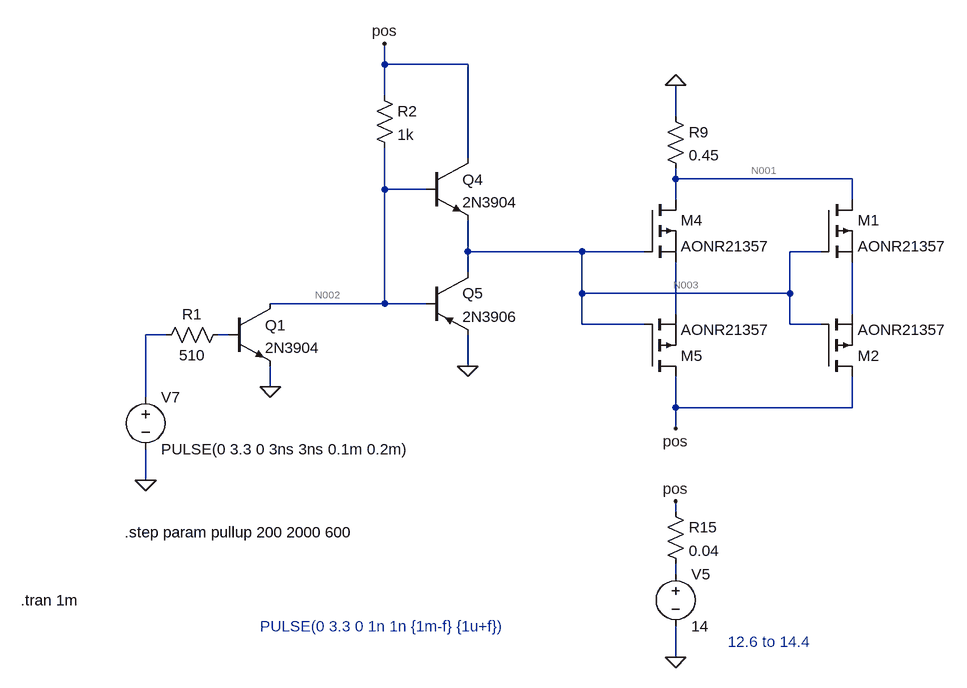
[diagram p0: schematic MOSFET switch circuit- correct.asc]
MOSFET switch circuit- correct.asc, the LTspice schematic file:
Version 4
SHEET 1 880 680
WIRE -1456 -272 -1456 -304
WIRE -1328 -272 -1456 -272
WIRE -1456 -224 -1456 -272
WIRE -1008 -192 -1008 -240
WIRE -1328 -128 -1328 -272
WIRE -1008 -96 -1008 -112
WIRE -736 -96 -1008 -96
WIRE -1456 -80 -1456 -144
WIRE -1392 -80 -1456 -80
WIRE -1008 -64 -1008 -96
WIRE -736 -64 -736 -96
WIRE -1328 16 -1328 -32
WIRE -1152 16 -1328 16
WIRE -1056 16 -1152 16
WIRE -784 16 -832 16
WIRE -1328 48 -1328 16
WIRE -1152 80 -1152 16
WIRE -832 80 -832 16
WIRE -832 80 -1152 80
WIRE -1456 96 -1456 -80
WIRE -1456 96 -1632 96
WIRE -1392 96 -1456 96
WIRE -1008 112 -1008 32
WIRE -736 112 -736 32
WIRE -1152 128 -1152 80
WIRE -1056 128 -1152 128
WIRE -832 128 -832 80
WIRE -784 128 -832 128
WIRE -1792 144 -1824 144
WIRE -1696 144 -1712 144
WIRE -1328 192 -1328 144
WIRE -1632 224 -1632 192
WIRE -1824 240 -1824 144
WIRE -1008 256 -1008 208
WIRE -736 256 -736 208
WIRE -736 256 -1008 256
WIRE -1008 288 -1008 256
WIRE -1824 368 -1824 320
WIRE -1008 416 -1008 400
WIRE -1008 512 -1008 496
WIRE -1008 640 -1008 592
FLAG -1824 368 0
FLAG -1008 640 0
FLAG -1008 288 pos
FLAG -1008 -240 0
FLAG -1008 400 pos
FLAG -1328 192 0
FLAG -1456 -304 pos
FLAG -1632 224 0
SYMBOL voltage -1008 496 R0
WINDOW 123 0 0 Left 0
WINDOW 39 0 0 Left 0
SYMATTR InstName V5
SYMATTR Value 14
SYMBOL pmos -1056 -64 R0
SYMATTR InstName M4
SYMATTR Value AONR21357
SYMBOL pmos -1056 208 M180
SYMATTR InstName M5
SYMATTR Value AONR21357
SYMBOL res -1024 -208 R0
SYMATTR InstName R9
SYMATTR Value 0.45
SYMBOL npn -1392 -128 R0
WINDOW 0 56 33 Left 2
SYMATTR InstName Q4
SYMATTR Value 2N3904
SYMBOL voltage -1824 224 R0
WINDOW 123 0 0 Left 0
WINDOW 39 0 0 Left 0
SYMATTR InstName V7
SYMATTR Value PULSE(0 3.3 0 3ns 3ns 0.1m 0.2m)
SYMBOL res -1024 400 R0
SYMATTR InstName R15
SYMATTR Value 0.04
SYMBOL pnp -1392 48 R0
SYMATTR InstName Q5
SYMATTR Value 2N3906
SYMBOL res -1472 -240 R0
SYMATTR InstName R2
SYMATTR Value 1k
SYMBOL npn -1696 96 R0
WINDOW 0 56 33 Left 2
SYMATTR InstName Q1
SYMATTR Value 2N3904
SYMBOL res -1696 128 R90
WINDOW 0 0 56 VBottom 2
WINDOW 3 32 56 VTop 2
SYMATTR InstName R1
SYMATTR Value 510
SYMBOL pmos -784 -64 R0
SYMATTR InstName M1
SYMATTR Value AONR21357
SYMBOL pmos -784 208 M180
SYMATTR InstName M2
SYMATTR Value AONR21357
TEXT -2016 552 Left 2 !.tran 1m
TEXT -1856 448 Left 2 !.step param pullup 200 2000 600
TEXT -928 616 Left 2 ;12.6 to 14.4
TEXT -1648 592 Left 2 ;PULSE(0 3.3 0 1n 1n {1m-f} {1u+f})

The netlist it stands for:
* MOSFET switch circuit- correct.asc
V5 N008 0 14
M4 N001 N003 N004 N004 AONR21357
M5 pos N003 N004 N004 AONR21357
R9 0 N001 0.45
Q4 pos N002 N003 0 2N3904
V7 N006 0 PULSE(0 3.3 0 3ns 3ns 0.1m 0.2m)
R15 pos N008 0.04
Q5 N003 N002 0 0 2N3906
R2 pos N002 1k
Q1 N002 N007 0 0 2N3904
R1 N007 N006 510
M1 N001 N003 N005 N005 AONR21357
M2 pos N003 N005 N005 AONR21357
.model NPN NPN
.model PNP PNP
.lib standard.bjt
.model NMOS NMOS
.model PMOS PMOS
.lib standard.mos
.tran 1m
.step param pullup 200 2000 600
* 12.6 to 14.4
* PULSE(0 3.3 0 1n 1n {1m-f} {1u+f})
.backanno
.end

* Results of the author's LTspice run, read from the files saved beside the schematic
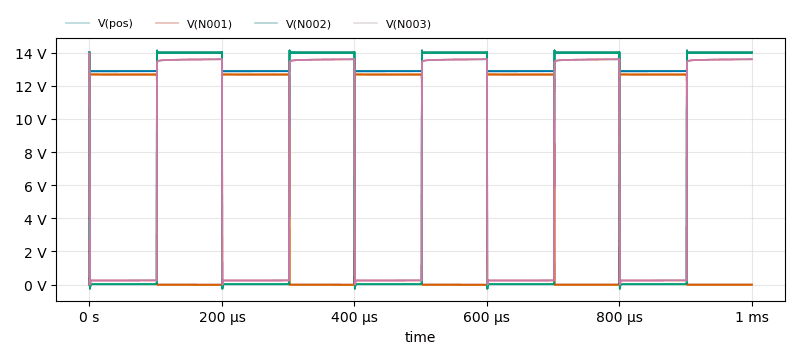
[diagram p1: Transient Analysis of MOSFET switch circuit- correct.asc, plotted from the saved traces]
* Transient Analysis, 4 runs:
*   V(pos) [pullup=200]: min 12.86 V, max 14 V, average 13.43 V, rms 13.44 V, last 14 V
*   V(pos) [pullup=800]: min 12.86 V, max 14 V, average 13.43 V, rms 13.44 V, last 14 V
*   V(pos) [pullup=1400]: min 12.86 V, max 14 V, average 13.43 V, rms 13.44 V, last 14 V
*   V(pos) [pullup=2000]: min 12.86 V, max 14 V, average 13.43 V, rms 13.44 V, last 14 V
*   V(N001) [pullup=200]: min -18.97 mV, max 12.68 V, average 6.446 V, rms 9.038 V, last 0 V
*   V(N001) [pullup=800]: min -18.97 mV, max 12.68 V, average 6.446 V, rms 9.038 V, last 0 V
*   V(N001) [pullup=1400]: min -18.97 mV, max 12.68 V, average 6.446 V, rms 9.038 V, last 0 V
*   V(N001) [pullup=2000]: min -18.97 mV, max 12.68 V, average 6.446 V, rms 9.038 V, last 0 V
*   V(N002) [pullup=200]: min -252.3 mV, max 14.13 V, average 6.901 V, rms 9.817 V, last 14 V
*   V(N002) [pullup=800]: min -252.3 mV, max 14.13 V, average 6.901 V, rms 9.817 V, last 14 V
*   V(N002) [pullup=1400]: min -252.3 mV, max 14.13 V, average 6.901 V, rms 9.817 V, last 14 V
*   V(N002) [pullup=2000]: min -252.3 mV, max 14.13 V, average 6.901 V, rms 9.817 V, last 14 V
*   V(N003) [pullup=200]: min 10.48 mV, max 13.97 V, average 6.814 V, rms 9.523 V, last 13.6 V
*   V(N003) [pullup=800]: min 10.48 mV, max 13.97 V, average 6.814 V, rms 9.523 V, last 13.6 V
*   V(N003) [pullup=1400]: min 10.48 mV, max 13.97 V, average 6.814 V, rms 9.523 V, last 13.6 V
*   V(N003) [pullup=2000]: min 10.48 mV, max 13.97 V, average 6.814 V, rms 9.523 V, last 13.6 V